# Altium project 总线驱动板-V1.0.PrjPCB
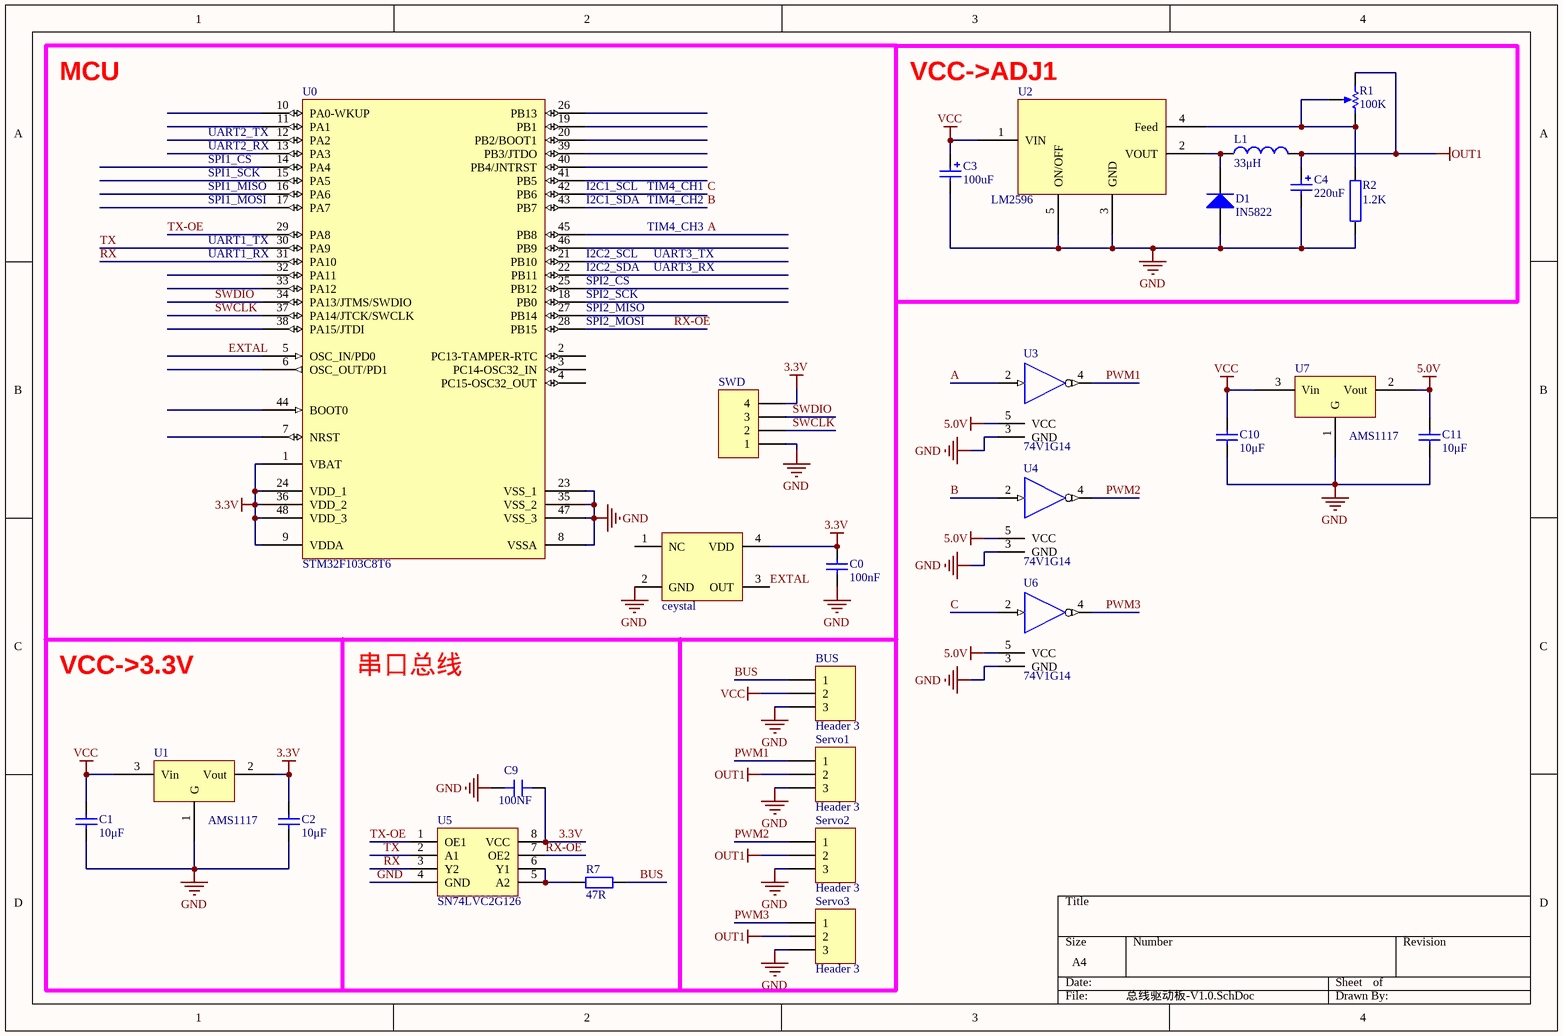
[diagram p0: 总线驱动板-V1.0.SchDoc]
1 sheet, 27 parts. Net scope: global (net labels, ports and power ports of the same name join across sheets).
Board file: 总线驱动板-V1.0.PcbDoc

## Sheet 总线驱动板-V1.0.SchDoc
size A4

### Parts
BUS  Header 3  [3P]
C0  value 100nF  [C0603]  (hidden comment: C0603)
C1  value 10μF  [Cap_0603]  (hidden comment: C0603)
C2  value 10μF  [Cap_0603]  (hidden comment: C0603)
C3  value 100uF  [Cap_electrolitic_φ3.5_8]  (hidden comment: CAP_B)
C4  value 220uF  [Cap_electrolitic_φ3.5_8]  (hidden comment: CAP_B)
C9  value 100NF  [Cap_0603]  (hidden comment: C0603)
C10  value 10μF  [Cap_0603]  (hidden comment: C0603)
C11  value 10μF  [Cap_0603]  (hidden comment: C0603)
ceystal  32MHz  [crystal]  (value not drawn)
D1  IN5822  [0805D]
L1  value 33μH  [INDUCTOR]  (hidden comment: INDUCTOR)
R1  value 100K  [SIP-3]  (hidden comment: RPot)
R2  value 1.2K  [Res_0603]  (hidden comment: R0603)
R7  value 47R  [Res_0603]  (hidden comment: R0603)
Servo1  Header 3  [3P]
Servo2  Header 3  [3P]
Servo3  Header 3  [3P]
SWD  Header 4  [HDR1X4_]  (value not drawn)
U0  STM32F103C8T6  [LC-LQFP-48_7x7x05P]
U1  AMS1117  [LC-SOT-89(SOT-89-3)]
U2  LM2596  [LC-TO-263-5]
U3  74V1G14  [SOT-23-5]
U4  74V1G14  [SOT-23-5]
U5  SN74LVC2G126  [VSSOP-8]
U6  74V1G14  [SOT-23-5]
U7  AMS1117  [LC-SOT-89(SOT-89-3)]

### Blocks framed on the sheet
MCU: C0 ceystal SWD U0

### Nets
3.3V: C0.2 C2.2 C9.1 ceystal.4(VDD) SWD.4 U0.1(VBAT) U0.9(VDDA) U0.24(VDD_1) U0.36(VDD_2) U0.48(VDD_3) U1.2(Vout) U5.8(VCC)
5.0V: C11.2 U3.5(VCC) U4.5(VCC) U6.5(VCC) U7.2(Vout)
GND: BUS.3 C0.1 C1.1 C2.1 C3.2 C4.2 C9.2 C10.1 C11.1 ceystal.2(GND) D1.A R2.2(BOT) Servo1.3 Servo2.3 Servo3.3 SWD.1 U0.8(VSSA) U0.23(VSS_1) U0.35(VSS_2) U0.47(VSS_3) U1.1(G) U2.3(GND) U2.5(ON/OFF) U3.3(GND) U4.3(GND) U5.4(GND) U6.3(GND) U7.1(G)
OUT1: C4.1 L1.2 R1.1(TOP) Servo1.2 Servo2.2 Servo3.2
VCC: BUS.2 C1.2 C3.1 C10.2 U1.3(Vin) U2.1(VIN) U7.3(Vin)
A: U0.45(PB8) U3.2(A)
B: U0.43(PB7) U4.2(A)
BUS: BUS.1 R7.1
C: U0.42(PB6) U6.2(A)
EXTAL: ceystal.3(OUT) U0.5(OSC_IN/PD0)
PWM1: Servo1.1 U3.4(Y)
PWM2: Servo2.1 U4.4(Y)
PWM3: Servo3.1 U6.4(Y)
RX: U0.31(PA10) U5.3(Y2)
RX-OE: U0.28(PB15) U5.7(OE2)
SWCLK: SWD.2 U0.37(PA14/JTCK/SWCLK)
SWDIO: SWD.3 U0.34(PA13/JTMS/SWDIO)
TX: U0.30(PA9) U5.2(A1)
TX-OE: U0.29(PA8) U5.1(OE1)
NetD1_K: D1.K L1.1 U2.2(VOUT)
NetR1_2: R1.2(BOT) R1.3(TAP) R2.1(TOP) U2.4(Feed)
NetR7_2: R7.2 U5.5(A2) U5.6(Y1)

Not connected (* = marked no-connect by the designer): ceystal 1(NC); U0 2(PC13-TAMPER-RTC) 3(PC14-OSC32_IN) 4(PC15-OSC32_OUT) 6(OSC_OUT/PD1) 7(NRST) 10(PA0-WKUP) 11(PA1) 12(PA2) 13(PA3) 14(PA4) 15(PA5) 16(PA6) 17(PA7) 18(PB0) 19(PB1) 20(PB2/BOOT1) 21(PB10) 22(PB11) 25(PB12) 26(PB13) 27(PB14) 32(PA11) 33(PA12) 38(PA15/JTDI) 39(PB3/JTDO) 40(PB4/JNTRST) 41(PB5) 44(BOOT0) 46(PB9)

### Notes on the sheet
- (near U2) VCC->ADJ1
- (near U0) SPI1_CS
- (near U0) SPI1_SCK
- (near U0) UART2_TX
- (near U0) UART2_RX
- (near U0) SPI1_MISO
- (near U0) SPI1_MOSI
- (near U0) UART1_TX
- (near U0) I2C1_SCL
- (near U0) I2C1_SDA
- TIM4_CH1
- TIM4_CH2
- TIM4_CH3
- (near U0) UART1_RX
- (near U0) I2C2_SCL
- (near U0) I2C2_SDA
- (near U0) SPI2_CS
- (near U0) SPI2_SCK
- (near U0) SPI2_MISO
- UART3_TX
- UART3_RX
- (near U0) SPI2_MOSI
- VCC->3.3V
- 串口总线

### Library data of the parts
BUS Servo1-Servo3 = Header 3: Header, 3-Pin; LatestRevisionDate: 17-Jul-2002; LatestRevisionNote: Re-released for DXP Platform.; Publisher: Altium Limited
C0 = Cap(0603): Capacitor (Semiconductor SIM Model); Published: 8-Jun-2000; LatestRevisionDate: 29-May-2009; LatestRevisionNote: IPC-7351 Footprint Added.; PackageReference: C1206; Publisher: Altium Limited; PackageDescription: Chip Capacitor
C1 C2 C10 C11 = Cap0603
C3 C4 = CAP_B: Polarized Capacitor (Radial); Published: 8-Jun-2000; LatestRevisionDate: 17-Jul-2002; LatestRevisionNote: Re-released for DXP Platform.; PackageReference: RB7.6-15; Publisher: Altium Limited; PackageDescription: Polarized Capacitor (Radial); 2 Leads
C9 = Cap 1: Pressure resistance: 16V; Accuracy: 5%; Packaging: C0603
ceystal = CRYSTAL OSCILLATOR
D1 = Diode
R1 = RPot: Potentiometer; pin to pad: 1>3 2>1 3>2; Sim Note: Enter the Resistance value and the set point into parameter fields.; Set Position: 0.5; Published: 8-Jun-2000; LatestRevisionDate: 17-Jul-2002; LatestRevisionNote: Re-released for DXP Platform.; PackageReference: VR5; Publisher: Altium Limited
R2 = RES: Resistor
R7 = Res2: Accuracy: 1%; Packaging: R0603
SWD = Header 4: Header, 4-Pin; LatestRevisionDate: 17-Jul-2002; LatestRevisionNote: Re-released for DXP Platform.; Publisher: Altium Limited
U0 = STM32F103C8T6: STM32 ARM-based 32-bit MCU with 64 Kbytes Flash, 48-pin LQFP, Industrial Temperature; Published: 30-May-2008; DatasheetVersion: rev6, Mar-2008; PackageVersion: Mar-2008; PackageReference: LQFP48; Publisher: Altium Limited; PackageDescription: 48-Pin Low-Profile Quad Flat Pack, 7 x 7 mm Body, 0.5 mm Pitch (LQFP48); ComponentLink1Description: Manufacturer Link; ComponentLink1URL: www.st.com/stm32; ComponentLink2Description: Datasheet; ComponentLink2URL: http://www.st.com/stonline/products/literature/ds/13587.pdf
U5 = SN74LVC2G126: Packaging: *